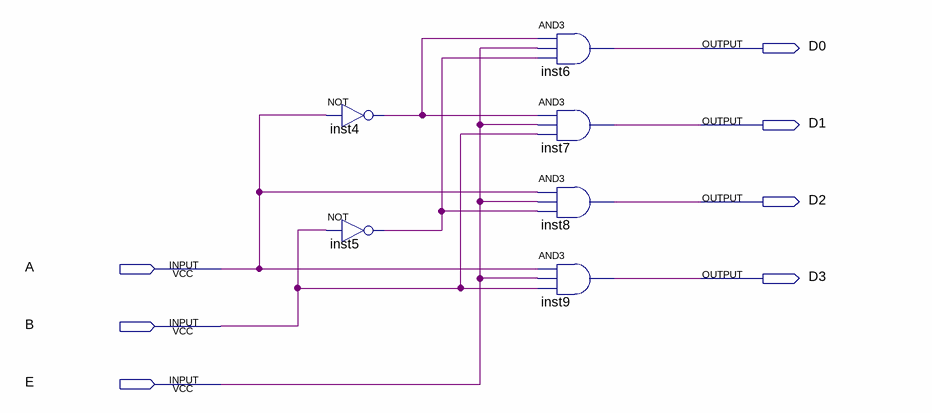
[diagram p0: schematic sheet]
// Quartus schematic Q2_scheme.bdf as structural Verilog: 6 symbols, 7 pins
module Q2_scheme (
  input  A,
  input  B,
  input  E,
  output D0,
  output D1,
  output D2,
  output D3
);

  wire inst4_out, inst5_out;

  not inst4 (inst4_out, A);
  not inst5 (inst5_out, B);
  and inst6 (D0, inst4_out, E, inst5_out);
  and inst7 (D1, inst4_out, E, B);
  and inst8 (D2, A, E, inst5_out);
  and inst9 (D3, A, E, B);
endmodule
